# EAGLE design fboard (EAGLE 9.6.2)
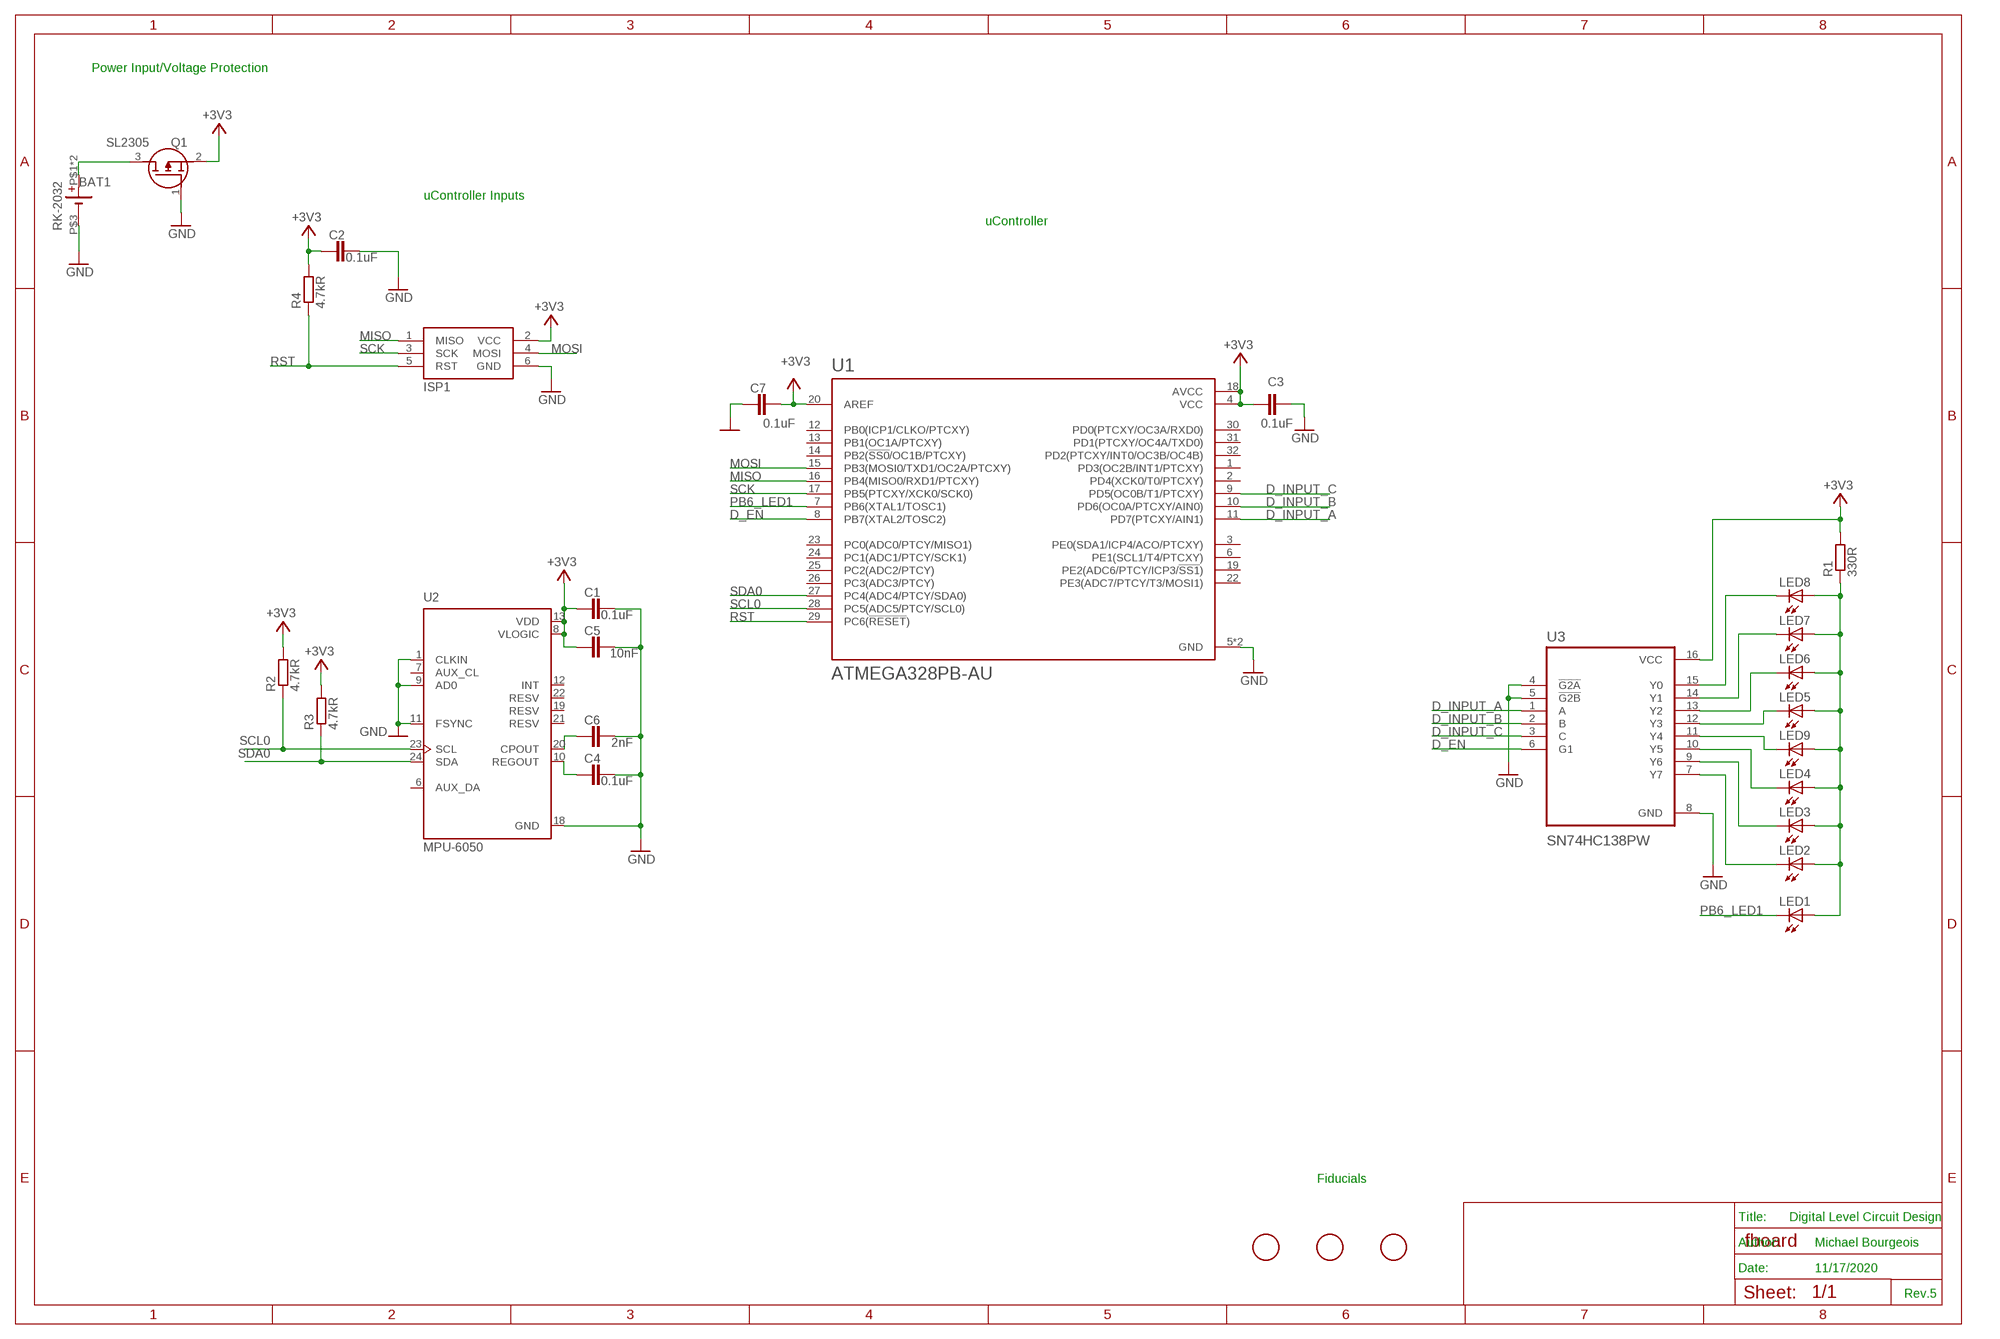
[diagram p0: schematic, sheet 1]

## Parts
BAT1  RK-2032  [RK-2032]
C1  0.1uF  C-EUC0805  [C0805]
C2  0.1uF  C-EUC0805  [C0805]
C3  0.1uF  C-EUC0805  [C0805]
C4  0.1uF  C-EUC0805  [C0805]
C5  10nF  C-EUC0805  [C0805]
C6  2nF  C-EUC0805  [C0805]
C7  0.1uF  C-EUC0805  [C0805]
ISP1  AVRISP-6  [AVRISP]
LED1  LEDCHIP-LED0805  [CHIP-LED0805]
LED2  LEDCHIP-LED0805  [CHIP-LED0805]
LED3  LEDCHIP-LED0805  [CHIP-LED0805]
LED4  LEDCHIP-LED0805  [CHIP-LED0805]
LED5  LEDCHIP-LED0805  [CHIP-LED0805]
LED6  LEDCHIP-LED0805  [CHIP-LED0805]
LED7  LEDCHIP-LED0805  [CHIP-LED0805]
LED8  LEDCHIP-LED0805  [CHIP-LED0805]
LED9  LEDCHIPLED_0805  [CHIPLED_0805]
Q1  SL2305  [SOT95P240X115-3N]
R1  330R  R-EU_R0805  [R0805]
R2  4.7kR  R-EU_R0805  [R0805]
R3  4.7kR  R-EU_R0805  [R0805]
R4  4.7kR  R-EU_R0805  [R0805]
U1  ATMEGA328PB-AU  [QFP80P900X900X120-32N]
U2  MPU-6050  [QFN50P400X400X95-24N]
U3  SN74HC138PW  [SOP65P640X120-16N]
U$4  FIDUCIAL  [FIDUCIAL_1MM]
U$5  FIDUCIAL  [FIDUCIAL_1MM]
U$6  FIDUCIAL  [FIDUCIAL_1MM]

## Nets
+3V3: C1.1 C2.1 C3.1 C5.1 C7.1 ISP1.2(VCC) Q1.2(S) R1.2 R2.2 R3.2 R4.2 U1.4(VCC) U1.18(AVCC) U1.20(AREF) U2.8(VLOGIC) U2.13(VDD) U3.16(VCC)
D_EN: U1.8(PB7(XTAL2/TOSC2)) U3.6(G1)
D_INPUT_A: U1.11(PD7(PTCXY/AIN1)) U3.1(A)
D_INPUT_B: U1.10(PD6(OC0A/PTCXY/AIN0)) U3.2(B)
D_INPUT_C: U1.9(PD5(OC0B/T1/PTCXY)) U3.3(C)
GND: BAT1.P$3(-) C1.2 C2.2 C3.2 C4.2 C5.2 C6.2 C7.2 ISP1.6(GND) Q1.1(G) U1.5(GND) U1.21(GND) U2.1(CLKIN) U2.9(AD0) U2.11(FSYNC) U2.18(GND) U3.4(!G2A) U3.5(!G2B) U3.8(GND)
LED_LINE: LED1.A LED2.A LED3.A LED4.A LED5.A LED6.A LED7.A LED8.A LED9.A R1.1
MISO: ISP1.1(MISO) U1.16(PB4(MISO0/RXD1/PTCXY))
MOSI: ISP1.4(MOSI) U1.15(PB3(MOSI0/TXD1/OC2A/PTCXY))
N$1: C4.1 U2.10(REGOUT)
N$2: C6.1 U2.20(CPOUT)
N$12: BAT1.P$1(+) BAT1.P$2(+) Q1.3(D)
PB6_LED1: LED1.C U1.7(PB6(XTAL1/TOSC1))
RST: ISP1.5(RST) R4.1 U1.29(PC6(!RESET!))
SCK: ISP1.3(SCK) U1.17(PB5(PTCXY/XCK0/SCK0))
SCL0: R2.1 U1.28(PC5(ADC5/PTCY/SCL0)) U2.23(SCL)
SDA0: R3.1 U1.27(PC4(ADC4/PTCY/SDA0)) U2.24(SDA)
Y0: LED8.C U3.15(Y0)
Y1: LED7.C U3.14(Y1)
Y2: LED6.C U3.13(Y2)
Y3: LED5.C U3.12(Y3)
Y4: LED9.C U3.11(Y4)
Y5: LED4.C U3.10(Y5)
Y6: LED3.C U3.9(Y6)
Y7: LED2.C U3.7(Y7)
Unconnected: U1.1(PD3(OC2B/INT1/PTCXY)) U1.2(PD4(XCK0/T0/PTCXY)) U1.3(PE0(SDA1/ICP4/ACO/PTCXY)) U1.6(PE1(SCL1/T4/PTCXY)) U1.12(PB0(ICP1/CLKO/PTCXY)) U1.13(PB1(OC1A/PTCXY)) U1.14(PB2(!SS0!/OC1B/PTCXY)) U1.19(PE2(ADC6/PTCY/ICP3/!SS1!)) U1.22(PE3(ADC7/PTCY/T3/MOSI1)) U1.23(PC0(ADC0/PTCY/MISO1)) U1.24(PC1(ADC1/PTCY/SCK1)) U1.25(PC2(ADC2/PTCY)) U1.26(PC3(ADC3/PTCY)) U1.30(PD0(PTCXY/OC3A/RXD0)) U1.31(PD1(PTCXY/OC4A/TXD0)) U1.32(PD2(PTCXY/INT0/OC3B/OC4B)) U2.6(AUX_DA) U2.7(AUX_CL) U2.12(INT) U2.19(RESV) U2.21(RESV) U2.22(RESV)

## Notes on the sheet
- Power Input/Voltage Protection
- uController Inputs
- uController
- Fiducials
- Title: | Digital Level Circuit Design
- Author: | Michael Bourgeois
- Date: | 11/17/2020
- Rev. | 5

## Library data of the parts
BAT1 = ECE_388_CustomParts_V1.1:RK-2032
C1-C7 = rcl:C-EU: CAPACITOR, European symbol; SPICEPREFIX: C
ISP1 = ECE388:AVRISP: AVR ISP HEADER Standard 6 pin header for AVR programming
LED1-LED9 = adafruit:LED: LED OSRAM: - CHIPLED LG R971, LG N971, LY N971, LG Q971, LY Q971, LO R971, LY R971 LH N974, LH R974 LS Q976, LO Q976, LY Q976 LO Q996 - Hyper CHIPLED LW Q18S LB Q993, LB Q99A, LB R99A - SideLED LS A670, LO A670, LY A670, LG A670, LP A670 LB A673, LV A673, LT A673, LW A673 LH A674 LY A675 LS A676, LA A676, LO A676, LY A676, LW A676 LS A679, LY A679, LG A679 - Hyper Micro SIDELED® LS Y876, LA Y876, LO Y876, LY Y876 LT Y87S - SmartLED LW L88C, LW L88S LB L89C, LB L89S, LG L890 LS L89K, LO L89K, LY L89K LS L896, LA L896, LO L896, LY L896 - TOPLED LS T670, LO T670, LY T670, LG T670, LP T670 LSG T670, LSP T670, LSY T670, LOP T670, LYG T670 LG T671, LOG T671, LSG T671 LB T673, LV T673, LT T673, LW T673 LH T674 LS T676, LA T676, LO T676, LY T676, LB T676, LH T676, LSB T676, LW T676 LB T67C, LV T67C, LT T67C, LS T67K, LO T67K, LY T67K, LW E67C LS E67B, LA E67B, LO E67B, LY E67B, LB E67C, LV E67C, LT E67C LW T67C LS T679, LY T679, LG T679 LS T770, LO T770, LY T770, LG T770, LP T770 LB T773, LV T773, LT T773, LW T773 LH T774 LS E675, LA E675, LY E675, LS T675 LS T776, LA T776, LO T776, LY T776, LB T776 LHGB T686 LT T68C, LB T68C - Hyper Mini TOPLED® LB M676 - Mini TOPLED Santana® LG M470 LS M47K, LO M47K, LY M47K Source: http://www.osram.convergy.de/
Q1 = SL2305:SL2305: P-Channel Power MOSFET Source: Datasheet <https://datasheet.lcsc.com/szlcsc/1909061434_SLKORMICRO-Elec-SL2305_C426573.pdf>; DESCRIPTION: P-Channel Power MOSFET; HEIGHT: 1.15mm; MANUFACTURER_NAME: Slkor(SLKORMICRO Elec.); MANUFACTURER_PART_NUMBER: SL2305
R1-R4 = rcl:R-EU_: RESISTOR, European symbol; SPICEPREFIX: R
U1 = ATMEGA328PB-AU:ATMEGA328PB-AU: ATmega Series 20 MHz 32 KB Flash 2 KB SRAM 8-Bit Microcontroller - TQFP-32 Check prices <https://pricing.snapeda.com/search/part/ATMEGA328PB-AU/?ref=eda>; AVAILABILITY: Good; DESCRIPTION: 8-bit Microcontrollers - MCU ATMEGA328PB 20MHZ IND TEMP; MF: Microchip Technology / Atmel; MP: ATMEGA328PB-AU; PACKAGE: None; PRICE: None; PURCHASE-URL: https://pricing.snapeda.com/search/part/ATMEGA328PB-AU/?ref=eda
U2 = MPU-6050:MPU-6050: MPU-6050 Six-Axis (Gyro + Accelerometer) MEMS MotionTracking™ Devices; DESCRIPTION: Accelerometer, Gyroscope, 6 Axis Sensor I²C Output; DIGI-KEY_PART_NUMBER: 1428-1007-1-ND; MF: TDK InvenSense; MP: MPU-6050; PACKAGE: VFQFN-24 TDK InvenSense; PURCHASE-URL: https://pricing.snapeda.com/search/part/MPU-6050/?ref=eda
U3 = SN74HC138PW:SN74HC138PW; AVAILABILITY: Unavailable; DESCRIPTION: 3-Line To 8-Line Decoders/Demultiplexers 16-TSSOP -40 to 85; MF: Texas Instruments; MP: SN74HC138PW; PACKAGE: TSSOP-16 Texas Instruments; PRICE: None; PURCHASE-URL: https://pricing.snapeda.com/search/part/SN74HC138PW/?ref=eda
U$4-U$6 = ECE388:FIDUCIAL: For use by pick and place machines to calibrate the vision/machine, 1mm By microbuilder.eu

## Board
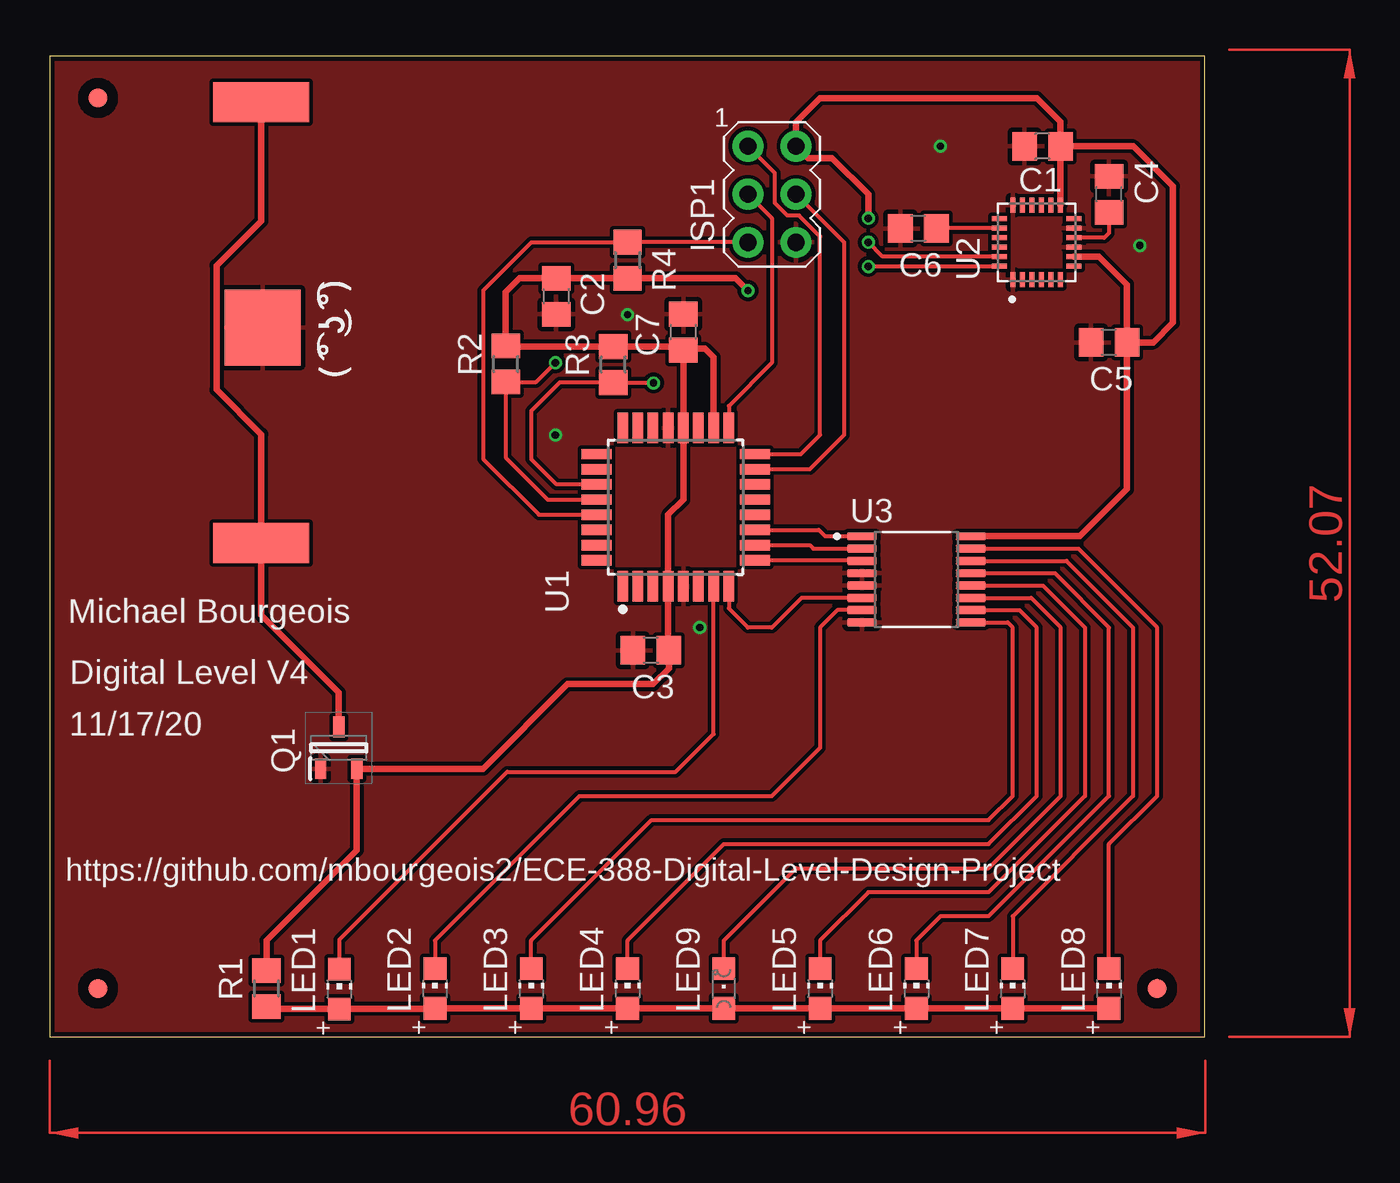
[diagram p1: board, top side]
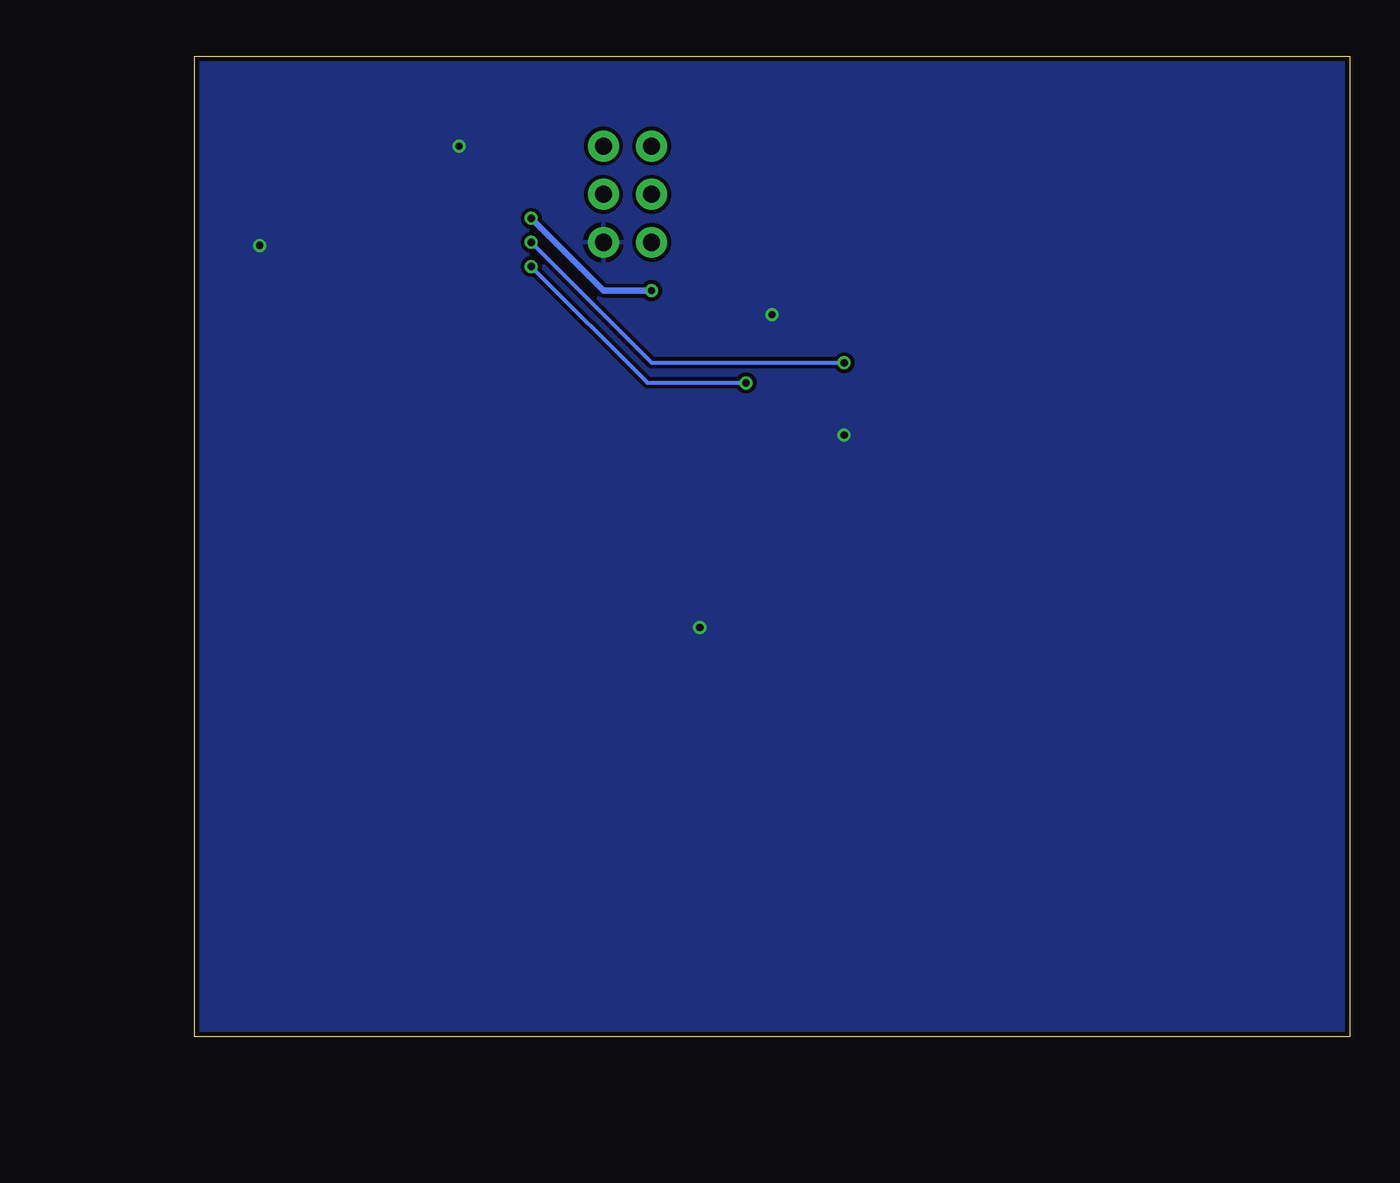
[diagram p2: board, bottom side, seen from below]

Size 60.94 x 51.74 mm. Coordinates in mm from the lower left corner, seen from the top.
Outline: 0,0 60.94,0 60.94,51.74 0,51.74 0,0
Copper layers (1*16): Top 0.035mm / dielectric 1.5mm / Bottom 0.035mm
Design rules "Dirty8TS": minimum track width 8mil, minimum drill 15mil, track to track 8mil, track to pad 8mil, pad to pad 8mil, via to via 8mil, smd to smd 0mil, copper to edge 10mil, drill to drill 10mil, minimum pad ring 10mil, minimum via ring 6mil, stop-mask expansion 2mil, vias tented up to drill 25mil, thermal gap 10mil

### Footprints (pad centres in the part's own frame; a part is rotated, then mirrored left to right if it is on the bottom)
RK-2032 = smd 2.1 x 5.05: P$1 22.21,3.53; P$2 -1.04,3.53 | smd 4 x 4: P$3 10.85,3.6
C0805 = smd 1.3 x 1.5: 1 -0.95,0; 2 0.95,0
AVRISP = drill 0.9 pad 1.626: 1 -1.27,2.54; 2 1.27,2.54; 3 -1.27,0; 4 1.27,0; 5 -1.27,-2.54; 6 1.27,-2.54
CHIP-LED0805 = smd 1.2 x 1.2: A 0,-1.05; C 0,1.05
CHIPLED_0805 = smd 1.2 x 1.2: A 0,-1.05; C 0,1.05
SOT95P240X115-3N = smd 1.1 x 0.6: 1 -1.1,0.95; 2 -1.1,-0.95; 3 1.1,0
R0805 = smd 1.3 x 1.5: 1 -0.95,0; 2 0.95,0
QFP80P900X900X120-32N = smd 1.6 x 0.55: 1 -4.18,2.8; 2 -4.18,2; 3 -4.18,1.2; 4 -4.18,0.4; 5 -4.18,-0.4; 6 -4.18,-1.2; 7 -4.18,-2; 8 -4.18,-2.8; 17 4.18,-2.8; 18 4.18,-2; 19 4.18,-1.2; 20 4.18,-0.4; 21 4.18,0.4; 22 4.18,1.2; 23 4.18,2; 24 4.18,2.8 | smd 0.55 x 1.6: 9 -2.8,-4.18; 10 -2,-4.18; 11 -1.2,-4.18; 12 -0.4,-4.18; 13 0.4,-4.18; 14 1.2,-4.18; 15 2,-4.18; 16 2.8,-4.18; 25 2.8,4.18; 26 2,4.18; 27 1.2,4.18; 28 0.4,4.18; 29 -0.4,4.18; 30 -1.2,4.18; 31 -2,4.18; 32 -2.8,4.18
QFN50P400X400X95-24N = smd 0.79 x 0.26: 1 -1.97,1.25; 2 -1.97,0.75; 3 -1.97,0.25; 4 -1.97,-0.25; 5 -1.97,-0.75; 6 -1.97,-1.25; 13 1.97,-1.25; 14 1.97,-0.75; 15 1.97,-0.25; 16 1.97,0.25; 17 1.97,0.75; 18 1.97,1.25 | smd 0.26 x 0.79: 7 -1.25,-1.97; 8 -0.75,-1.97; 9 -0.25,-1.97; 10 0.25,-1.97; 11 0.75,-1.97; 12 1.25,-1.97; 19 1.25,1.97; 20 0.75,1.97; 21 0.25,1.97; 22 -0.25,1.97; 23 -0.75,1.97; 24 -1.25,1.97
SOP65P640X120-16N = smd 1.57 x 0.41: 1 -2.87,2.275; 2 -2.87,1.625; 3 -2.87,0.975; 4 -2.87,0.325; 5 -2.87,-0.325; 6 -2.87,-0.975; 7 -2.87,-1.625; 8 -2.87,-2.275; 9 2.87,-2.275; 10 2.87,-1.625; 11 2.87,-0.975; 12 2.87,-0.325; 13 2.87,0.325; 14 2.87,0.975; 15 2.87,1.625; 16 2.87,2.275
FIDUCIAL_1MM = smd 1 x 1: 1 0,0

### Placement (x,y rotation side)
BAT1  7.62,48.26 270 top
C1  52.37,46.97 180 top
C2  26.71,39.07 270 top
C3  31.71,20.39 180 top
C4  55.88,44.45 90 top
C5  55.88,36.63 180 top
C6  45.83,42.64 180 top
C7  33.42,37.18 90 top
ISP1  38.1,44.45 0 top
LED1  15.27,2.51 0 top
LED2  20.32,2.54 0 top
LED3  25.4,2.54 0 top
LED4  30.48,2.54 0 top
LED5  40.64,2.54 0 top
LED6  45.72,2.54 0 top
LED7  50.8,2.54 0 top
LED8  55.88,2.54 0 top
LED9  35.56,2.54 0 top
Q1  15.24,15.24 90 top
R1  11.43,2.54 90 top
R2  24.05,35.49 90 top
R3  29.72,35.46 90 top
R4  30.48,40.97 270 top
U1  33.02,27.94 90 top
U2  52.07,41.91 90 top
U3  45.72,24.13 0 top
U$4  58.42,2.54 0 top
U$5  2.54,49.53 0 top
U$6  2.54,2.54 0 top

### Tracks (layer width: path | path; a pad name or v marks a point on that pad's centre or on a via)
+3V3  (via drill 0.38)
  Top 0.305: C7.1 | C7.1 33.23,36.41 | C2.1 | C1.1 | 32.62,20.43 C3.1 | C7.1 33.5,36.3
  Top 0.33: U2.8 55.36,41.16 56.83,39.69 C5.1 | v43.18,43.18 43.18,44.45 41.28,46.35 40.01,46.35 ISP1.2 39.37,48.26 40.64,49.53 52.07,49.53 53.33,48.27 C1.1 57.17,46.97 59.26,44.88 59.26,37.67 58.22,36.63 C5.1 | U3.16 54.35,26.4 56.83,28.89 C5.1 | C7.1 U1.20 33.42,28.34 32.62,27.54 U1.4 32.62,20.43 | 33.23,36.41 R3.2 24.08,36.41 R2.2 24.05,39.29 24.78,40.01 C2.1 | v36.83,39.37 36.18,40.02 R4.2 C2.1 | R1.2 11.43,5.08 16.19,9.84 Q1.2 22.86,14.14 27.32,18.6 31.84,18.6 32.66,19.42 C3.1 | U1.18 35.02,35.85 34.56,36.3 33.5,36.3 | C1.1 U2.13
  Bottom 0.33: v43.18,43.18 39.37,39.37 v36.83,39.37
D_EN
  Top 0.203: U1.8 35.82,22.6 36.83,21.59 38.1,21.59 39.67,23.15 U3.6
D_INPUT_A
  Top 0.203: U3.1 40.91,26.4 40.57,26.74 U1.11
D_INPUT_B
  Top 0.203: U1.10 40.1,25.94 40.29,25.75 U3.2
D_INPUT_C
  Top 0.203: U1.9 42.82,25.14 U3.3
GND  (via drill 0.38)
  other vias: 46.99,46.99 34.29,21.59 26.67,31.75 30.48,38.1 57.51,41.75
  pour Bottom: -2.79,-1.73 -2.79,54.15 75.95,54.15 77.22,55.42 77.22,-6.81 75.95,-8.08 -2.79,-8.08
  pour Top: -10.41,-11.89 -10.41,55.42 -7.87,57.96 75.95,57.96 81.03,52.88 81.03,-11.89
LED_LINE
  Top 0.203: R1.1 11.56,1.46
  Top 0.33: LED8.A LED7.A LED6.A LED5.A LED9.A LED4.A LED3.A LED2.A 20.29,1.46 LED1.A 11.56,1.46
MISO
  Top 0.203: U1.16 39.63,30.74 40.64,31.75 40.64,42.22 39.53,43.33 38.91,43.33 38.25,43.99 38.25,45.57 ISP1.1
MOSI
  Top 0.203: U1.15 40.1,29.94 41.91,31.75 41.91,41.91 ISP1.4
N$1
  Top 0.203: U2.10 55.63,42.16 55.88,42.41 C4.1
N$2
  Top 0.203: C6.1 46.8,42.66 U2.20
N$12
  Top 0.33: Q1.3 15.24,18.15 11.15,22.24 BAT1.P$1 11.15,31.78 8.8,34.13 8.8,40.69 11.15,43.04 BAT1.P$2
PB6_LED1
  Top 0.203: U1.7 35.02,15.97 33.02,13.97 24.13,13.97 15.27,5.11 LED1.C
RST
  Top 0.203: U1.29 25.8,27.54 22.86,30.48 22.86,39.37 25.41,41.92 R4.1 30.49,41.91 ISP1.5
SCK
  Top 0.203: U1.17 35.82,33.28 38.1,35.56 38.1,43.18 ISP1.3
SCL0  (via drill 0.38)
  Top 0.203: U1.28 26.27,28.34 24.05,30.56 R2.1 25.65,34.54 v26.67,35.56 | U2.23 43.93,41.16 v43.18,41.91
  Bottom 0.203: v43.18,41.91 36.83,35.56 v26.67,35.56
SDA0  (via drill 0.38)
  Top 0.203: U1.27 26.74,29.14 25.4,30.48 25.4,33.02 26.89,34.51 R3.1 31.84,34.51 v31.85,34.5 | U2.24 50.08,40.64 v43.18,40.64
  Bottom 0.203: v43.18,40.64 37.05,34.51 v31.86,34.51 v31.85,34.5
Y0
  Top 0.203: U3.15 54.26,25.75 58.42,21.59 58.42,12.7 55.88,10.16 LED8.C
Y1
  Top 0.203: U3.14 53.64,25.1 57.15,21.59 57.15,12.7 50.8,6.35 LED7.C
Y2
  Top 0.203: U3.13 53.02,24.45 55.88,21.59 55.88,12.7 49.53,6.35 46.99,6.35 45.72,5.08 LED6.C
Y3
  Top 0.203: U3.12 52.4,23.8 54.61,21.59 54.61,12.7 49.53,7.62 43.18,7.62 40.64,5.08 LED5.C
Y4
  Top 0.203: U3.11 51.78,23.15 53.34,21.59 53.34,12.7 49.53,8.89 39.37,8.89 35.56,5.08 LED9.C
Y5
  Top 0.203: U3.10 51.16,22.5 52.07,21.59 52.07,12.7 49.53,10.16 35.56,10.16 30.48,5.08 LED4.C
Y6
  Top 0.203: U3.9 50.54,21.85 50.8,21.59 50.8,12.7 49.53,11.43 31.75,11.43 25.4,5.08 LED3.C
Y7
  Top 0.203: U3.7 41.56,22.5 40.64,21.59 40.64,15.24 38.1,12.7 27.94,12.7 20.32,5.08 LED2.C
(copper drawn outside any net)
  shapes: Top area x2

### Text on the board
tPlace: Michael Bourgeois | Digital Level V4 | 11/17/20 | https://github.com/mbourgeois2/ECE-388-Digital-Level-Design-Project